# Altium schematic sheet FRONT-UNIT-7.SCHDOC: FRONT-UNIT-7INCH
size A2; DocumentNumber: 1; Revision: 2.0; SheetNumber: 1; SheetTotal: 18; DocumentName: Лист 1.SCHDOC
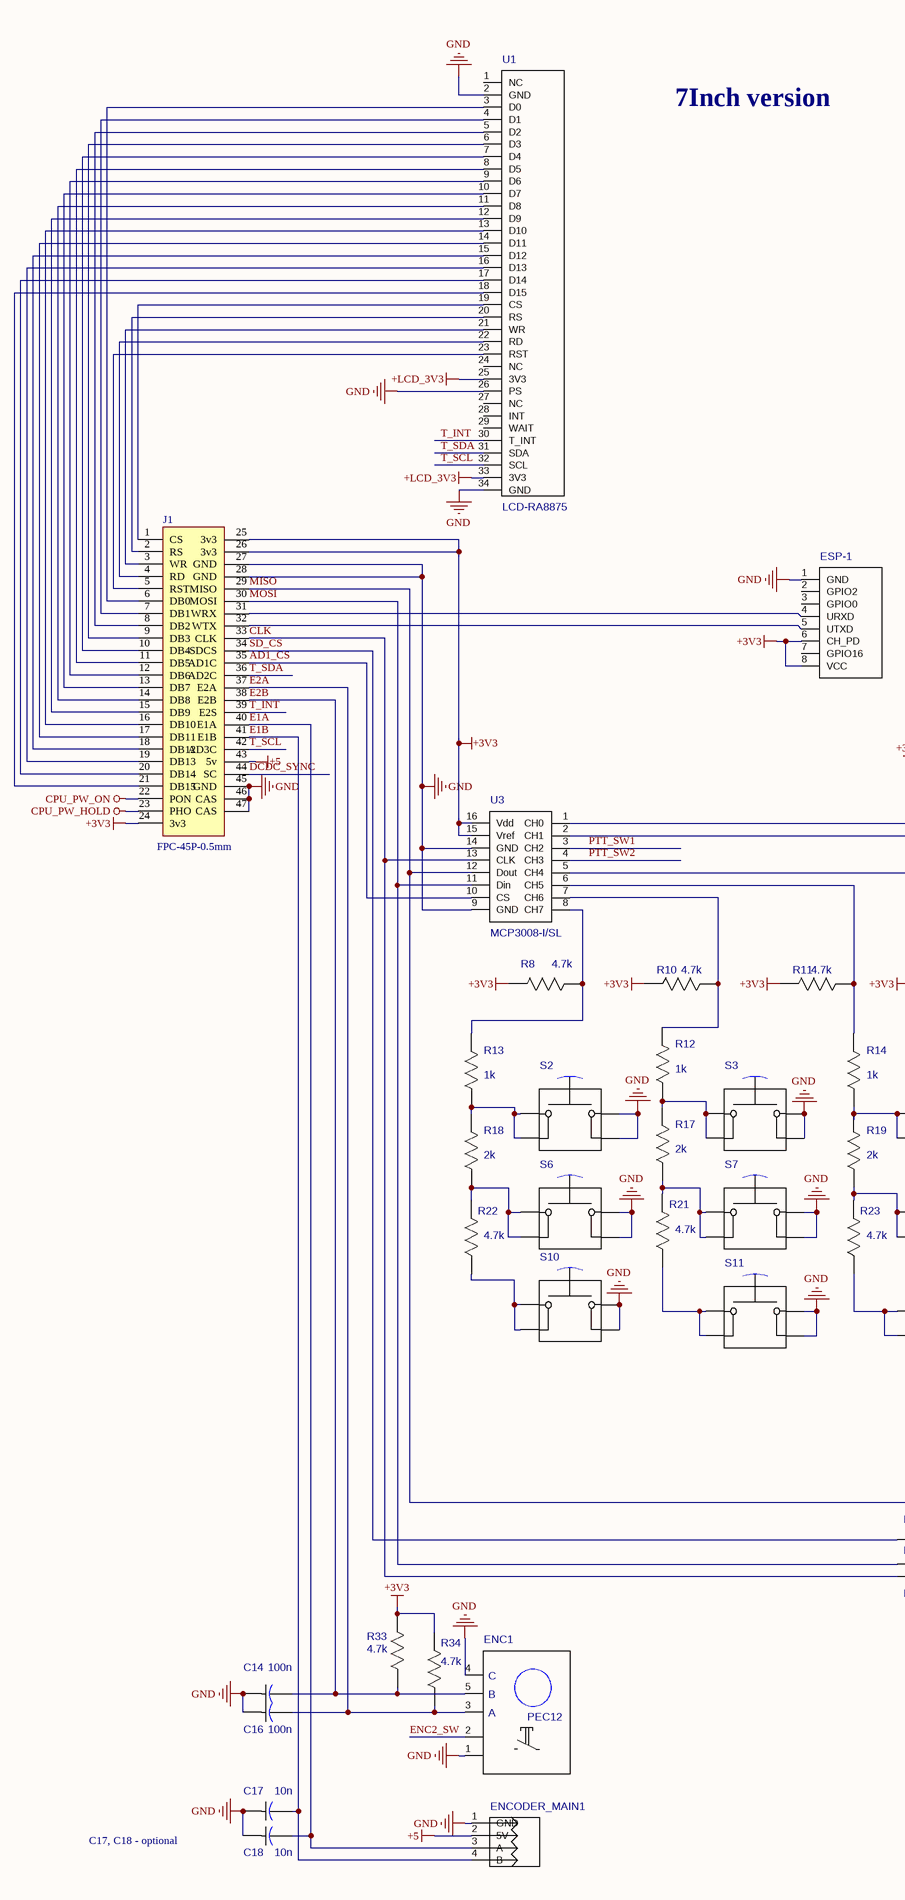
[diagram p0: FRONT-UNIT-7.SCHDOC, left]
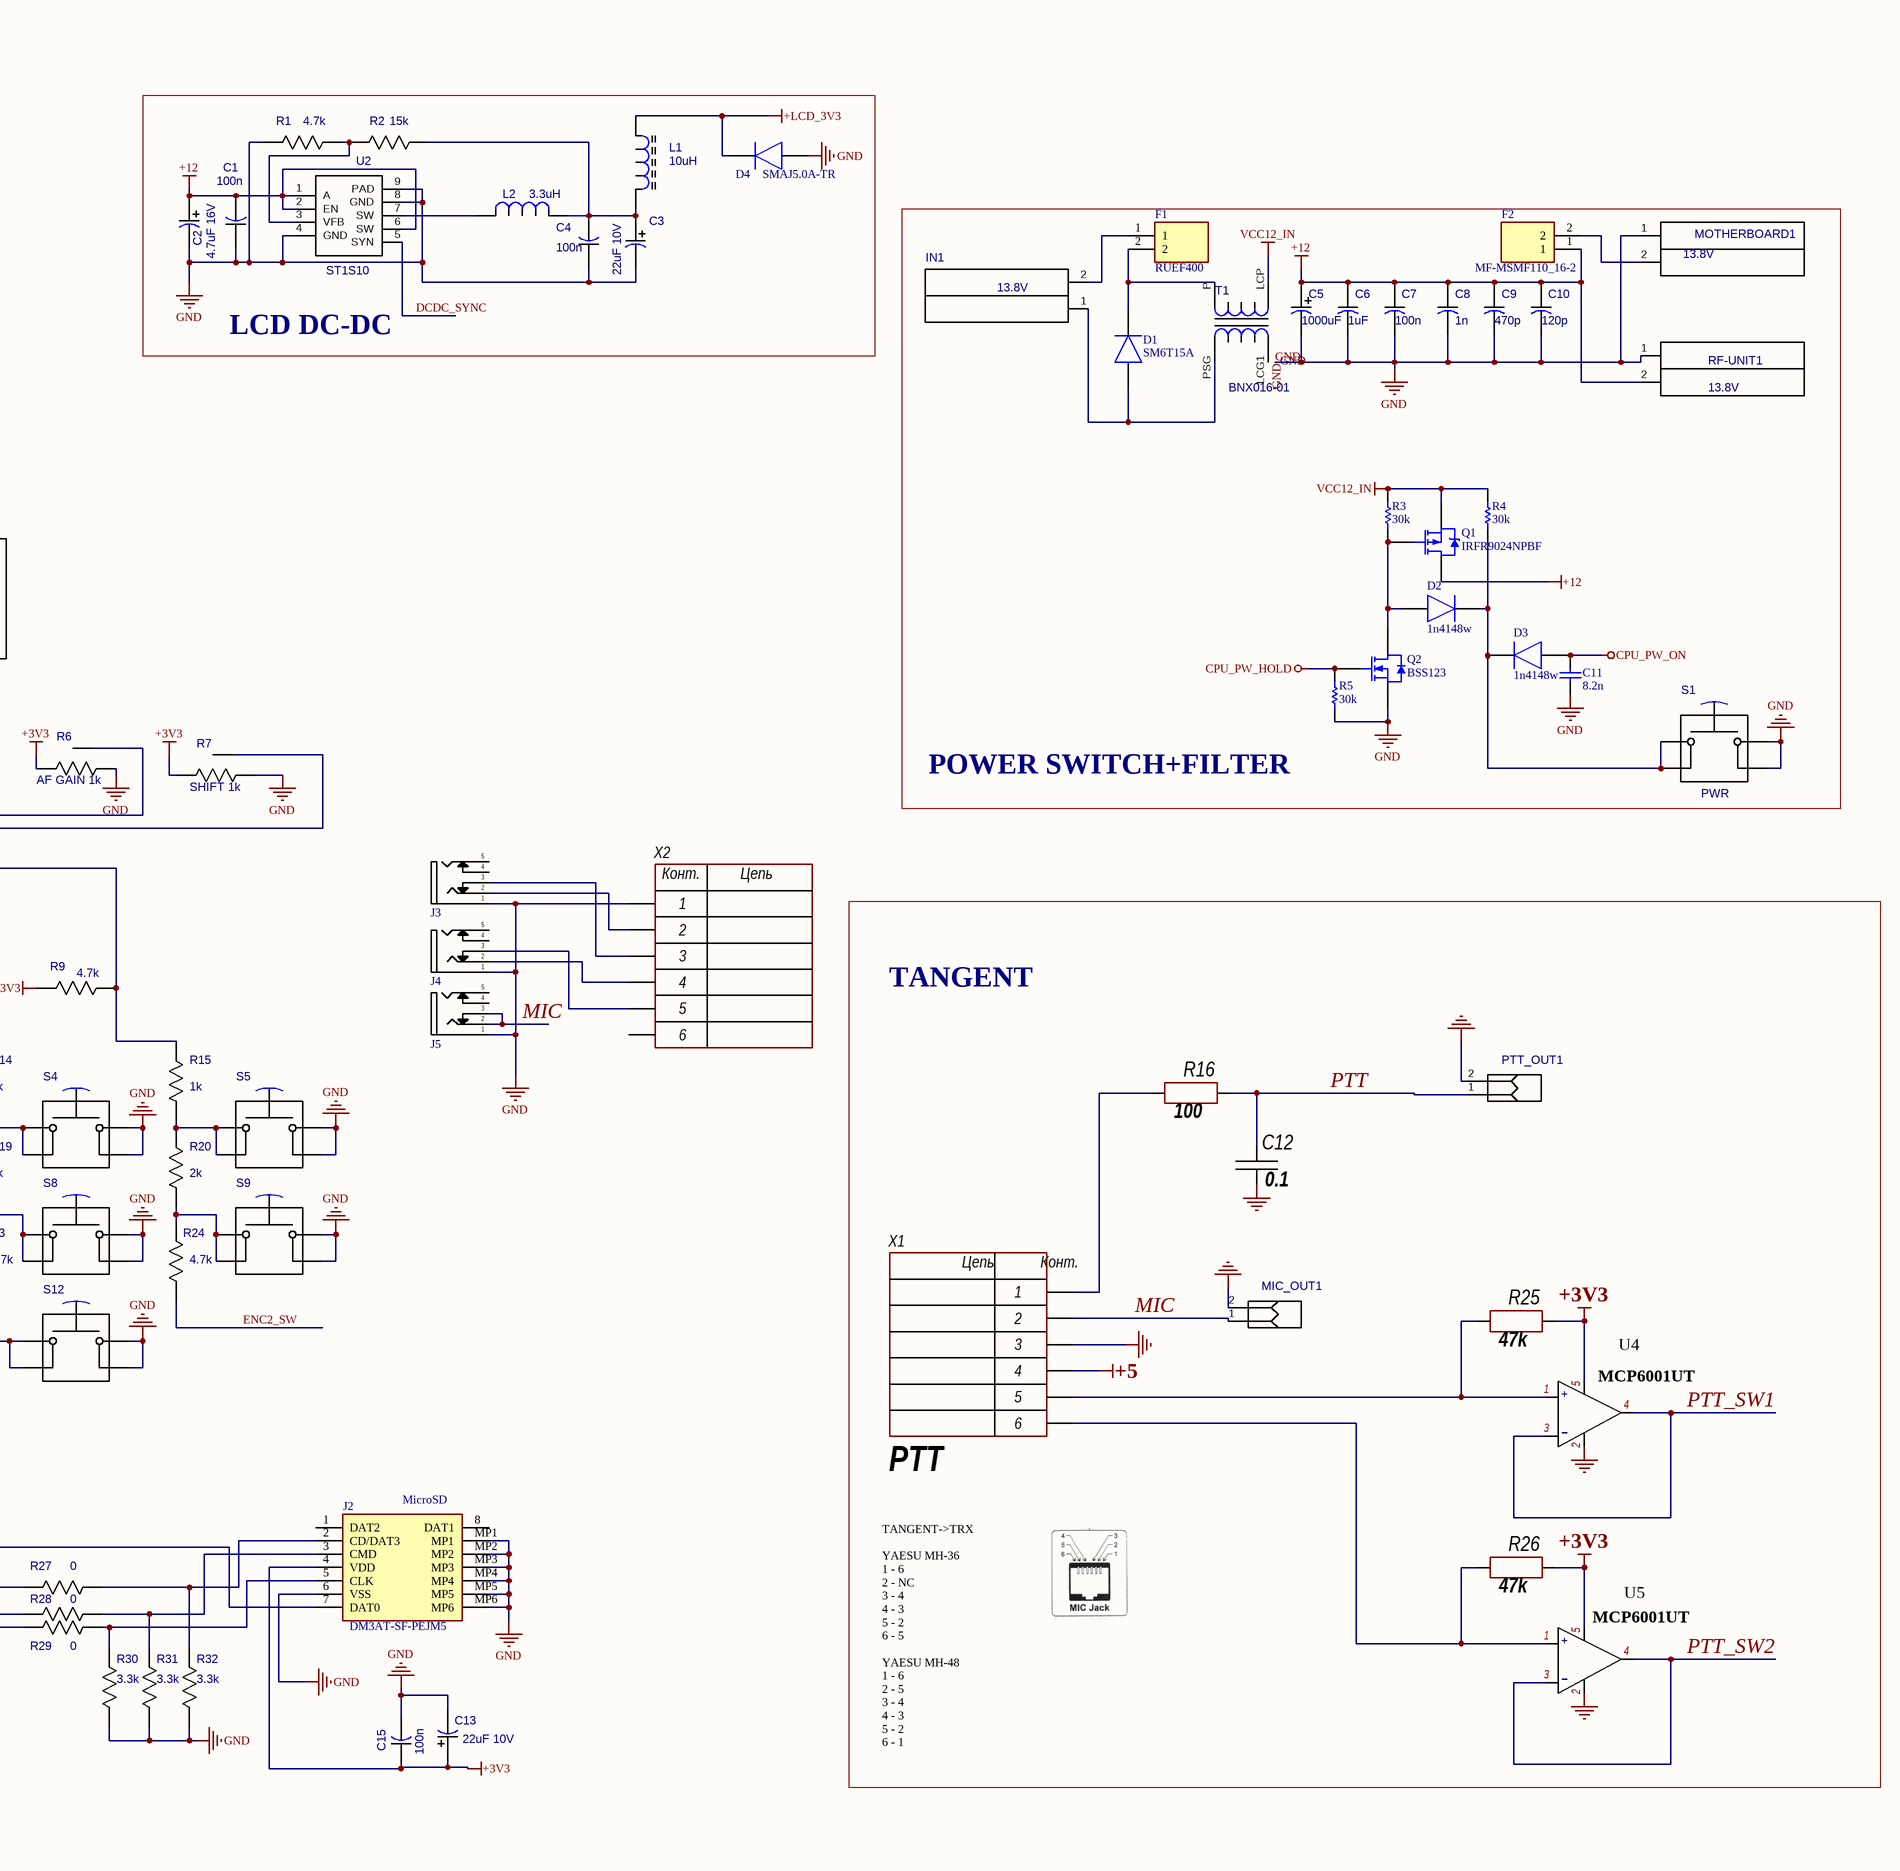
[diagram p1: FRONT-UNIT-7.SCHDOC, right]

## Parts
C1  100n  [CAP_0805]
C2  4.7uF 16V  [CAPAE_6.6x6.6h5.4]
C3  22uF 10V  [CAPAE_4.3x4.3h5.4]
C4  100n  [CAP_0805]
C5  1000uF  [CAP250RP]
C6  1uF  [CAP_1206]
C7  100n  [CAP_1206]
C8  1n  [CAP_1206]
C9  470p  [CAP_1206]
C10  120p  [CAP_1206]
C11  8.2n  [CAPC2013X94X50LL20T25]
C12  0.1  [CH0805C]
C13  22uF 10V  [EEEFC_sizeB]
C14  100n  [CAP_0805]
C15  100n  [CAP_0805]
C16  100n  [CAP_0805]
C17  10n  [CAP_0805]
C18  10n  [CAP_0805]
D1  SM6T15A  [SMBJ36CATR]
D2  1n4148w  [SOD3716X135N]
D3  1n4148w  [SOD3716X135N]
D4  SMAJ5.0A-TR  [SMBJ36CATR]
ENC1  PEC12  [PEC12]
ENCODER_MAIN1  OPTICAL ENCODER  [644456-4]  (value not drawn)
ESP-1  ESP-01 ESP8266  [ESP-01 ESP8266]  (value not drawn)
F1  RUEF400  [RUEF400]
F2  MF-MSMF110_16-2  [FUSC4632X85N]
IN1  value 13.8V  [JX2]  (hidden comment: JX2)
J1  FPC-45P-0.5mm  [FH12S45S05SH60]
J2  DM3AT-SF-PEJM5  [DM3ATSFPEJM5]
J3  PJ-3,5  [Audio-PJ-392]  (value not drawn)
J4  PJ-3,5  [Audio-PJ-392]  (value not drawn)
J5  PJ-3,5  [Audio-PJ-392]  (value not drawn)
L1  10uH  [IND_FERRITE_CORE]
L2  3.3uH  [IND_1812]
MIC_OUT1  MIC_OUT  [51022-0200]  (value not drawn)
MOTHERBOARD1  value 13.8V  [JX2]  (hidden comment: JX2)
PTT_OUT1  PTT_OUT  [51022-0200]  (value not drawn)
Q1  IRFR9024NPBF  [ONSC-DPAK-3-369C-01_V]
Q2  BSS123  [FAIR-SOT23-3_V]
R1  4.7k  [RES_0805]
R2  15k  [RES_0805]
R3  30k  [RESC2013X60X40NL20T25]
R4  30k  [RESC2013X60X40NL20T25]
R5  30k  [RESC2013X60X40NL20T25]
R6  value AF GAIN 1k  [PTV09]  (hidden comment: ptv09a-4225f-b102)
R7  value SHIFT 1k  [PTV09]  (hidden comment: ptv09a-4225f-b102)
R8  4.7k  [RES_0805]
R9  4.7k  [RES_0805]
R10  4.7k  [RES_0805]
R11  4.7k  [RES_0805]
R12  1k  [RES_0805]
R13  1k  [RES_0805]
R14  1k  [RES_0805]
R15  1k  [RES_0805]
R16  100  [CH0805R]
R17  2k  [RES_0805]
R18  2k  [RES_0805]
R19  2k  [RES_0805]
R20  2k  [RES_0805]
R21  4.7k  [RES_0805]
R22  4.7k  [RES_0805]
R23  4.7k  [RES_0805]
R24  4.7k  [RES_0805]
R25  47k  [CH0805R]
R26  47k  [CH0805C]
R27  0  [RES_0805]
R28  0  [RES_0805]
R29  0  [RES_0805]
R30  3.3k  [RES_0805]
R31  3.3k  [RES_0805]
R32  3.3k  [RES_0805]
R33  4.7k  [RES_0805]
R34  4.7k  [RES_0805]
RF-UNIT1  value 13.8V  [JX2]  (hidden comment: JX2)
S1  value PWR  [PTS645SK50LFS]  (hidden comment: PTS645SK50LFS)
S2  PTS645SK50LFS  [PTS645SK50LFS]  (value not drawn)
S3  PTS645SK50LFS  [PTS645SK50LFS]  (value not drawn)
S4  PTS645SK50LFS  [PTS645SK50LFS]  (value not drawn)
S5  PTS645SK50LFS  [PTS645SK50LFS]  (value not drawn)
S6  PTS645SK50LFS  [PTS645SK50LFS]  (value not drawn)
S7  PTS645SK50LFS  [PTS645SK50LFS]  (value not drawn)
S8  PTS645SK50LFS  [PTS645SK50LFS]  (value not drawn)
S9  PTS645SK50LFS  [PTS645SK50LFS]  (value not drawn)
S10  PTS645SK50LFS  [PTS645SK50LFS]  (value not drawn)
S11  PTS645SK50LFS  [PTS645SK50LFS]  (value not drawn)
S12  PTS645SK50LFS  [PTS645SK50LFS]  (value not drawn)
T1  BNX016-01  [TRANSF_ICORE]
U1  LCD-RA8875  [LCD-RA8875]
U2  ST1S10  [ST1S10]
U3  MCP3008-I/SL  [MCP3008-I/SL]
U4  MCP6001UT  [SOT23-5]
U5  MCP6001UT  [SOT23-5]
X1  PTT  [CON: PLS-6]
X2  PTT  [CON: PLS-6]  (value not drawn)

## Blocks framed on the sheet
LCD DC-DC: C1-C4 D4 L1 L2 R1 R2 U2
POWER SWITCH+FILTER: C5-C11 D1-D3 F1 F2 IN1 MOTHERBOARD1 Q1 Q2 R3-R5 RF-UNIT1 S1 T1
TANGENT: C12 MIC_OUT1 PTT_OUT1 R16 R25 R26 U4 U5 X1

## Nets
+3V3: C13.1(PLUS) C15.1 ESP-1.6(CH_PD) ESP-1.8(VCC) J1.24(3v3) J1.25(3v3) J1.26(3v3) J2.4(VDD) R6.1(CW) R7.1(CW) R8.2 R9.2 R10.2 R11.2 R25.2 R26.2 R33.2 R34.2 U3.15(Vref) U3.16(Vdd) U4.5 U5.5
+5: ENCODER_MAIN1.2(5V) J1.43(5v) X1.4
+12: C1.2 C2.1(PLUS) C5.1(PLUS) C6.1 C7.1 C8.1 C9.1 C10.1 F2.1 Q1.4(D) RF-UNIT1.2 U2.1(A) U2.2(EN) U2.6(SW)
+LCD_3V3: D4.1(K) L1.1(A) U1.25(3V3) U1.33(3V3)
CPU_PW_HOLD: J1.23(PHO) Q2.1(G) R5.2
CPU_PW_ON: C11.2 D3.2(A) J1.22(PON)
GND: C1.1 C2.2(MINUS) C3.2(MINUS) C4.1 C5.2(MINUS) C6.2 C7.2 C8.2 C9.2 C10.2 C11.1 C12.1 C13.2(MINUS) C14.1 C15.2 C16.1 C17.1 C18.1 D4.2(A) ENC1.1 ENC1.4(C) ENCODER_MAIN1.1(GND) ESP-1.1(GND) J1.27(GND) J1.28(GND) J1.45(GND) J1.46(CAS) J1.47(CAS) J2.6(VSS) J2.MP1 J2.MP2 J2.MP3 J2.MP4 J2.MP5 J2.MP6 J3.1 J4.1 J5.1 MIC_OUT1.2 MOTHERBOARD1.1 PTT_OUT1.2 Q2.2(S) R1.1 R5.1 R6.3(CCW) R7.3(CCW) R30.1 R31.1 R32.1 RF-UNIT1.1 S1.3(B) S1.4(B) S2.3(B) S2.4(B) S3.3(B) S3.4(B) S4.3(B) S4.4(B) S5.3(B) S5.4(B) S6.3(B) S6.4(B) S7.3(B) S7.4(B) S8.3(B) S8.4(B) S9.3(B) S9.4(B) S10.3(B) S10.4(B) S11.3(B) S11.4(B) S12.3(B) S12.4(B) T1.LCG1(S2) U1.2(GND) U1.26(PS) U1.34(GND) U2.4(GND) U2.8(GND) U2.9(PAD) U3.9(GND) U3.14(GND) U4.2 U5.2 X1.3 X2.1
VCC12_IN: Q1.3(S) R3.2 R4.2 T1.LCP(P2)
AD1_CS: J1.35(AD1C) U3.10(CS)
CLK: J1.33(CLK) R29.2 U3.13(CLK)
DCDC_SYNC: J1.44(SC) U2.5(SYN)
E1A: C18.2 ENCODER_MAIN1.3(A) J1.40(E1A)
E1B: C17.2 ENCODER_MAIN1.4(B) J1.41(E1B)
E2A: C16.2 ENC1.3(A) J1.37(E2A) R34.1
E2B: C14.2 ENC1.5(B) J1.38(E2B) R33.1
ENC2_SW: ENC1.2 R24.1
MIC: J5.2 J5.3 MIC_OUT1.1 X1.2
MISO: J1.29(MISO) J2.7(DAT0) U3.12(Dout)
MOSI: J1.30(MOSI) R28.2 U3.11(Din)
PTT: C12.2 PTT_OUT1.1 R16.2
PTT_SW1: U3.3(CH2) U4.3 U4.4
PTT_SW2: U3.4(CH3) U5.3 U5.4
SD_CS: J1.34(SDCS) R27.2
T_INT: J1.39(E2S) U1.30(T_INT)
T_SCL: J1.42(AD3C) U1.32(SCL)
T_SDA: J1.36(AD2C) U1.31(SDA)
NetC3_1: C3.1(PLUS) C4.2 L1.2(B) L2.2 R2.2
NetD1_1: D1.1(K) F1.2 T1.P(P1)
NetD1_2: D1.2(A) IN1.1 T1.PSG(S1)
NetD2_1: D2.1(K) D3.1(K) R4.1 S1.1(A) S1.2(A)
NetD2_2: D2.2(A) Q1.1(G) Q2.3(D) R3.1
NetESP-1_4: ESP-1.4(URXD) J1.31(WRX)
NetESP-1_5: ESP-1.5(UTXD) J1.32(WTX)
NetF1_1: F1.1 IN1.2
NetF2_2: F2.2 MOTHERBOARD1.2
NetJ1_1: J1.1(CS) U1.19(CS)
NetJ1_2: J1.2(RS) U1.20(RS)
NetJ1_3: J1.3(WR) U1.21(WR)
NetJ1_4: J1.4(RD) U1.22(RD)
NetJ1_5: J1.5(RST) U1.23(RST)
NetJ1_6: J1.6(DB0) U1.3(D0)
NetJ1_7: J1.7(DB1) U1.4(D1)
NetJ1_8: J1.8(DB2) U1.5(D2)
NetJ1_9: J1.9(DB3) U1.6(D3)
NetJ1_10: J1.10(DB4) U1.7(D4)
NetJ1_11: J1.11(DB5) U1.8(D5)
NetJ1_12: J1.12(DB6) U1.9(D6)
NetJ1_13: J1.13(DB7) U1.10(D7)
NetJ1_14: J1.14(DB8) U1.11(D8)
NetJ1_15: J1.15(DB9) U1.12(D9)
NetJ1_16: J1.16(DB10) U1.13(D10)
NetJ1_17: J1.17(DB11) U1.14(D11)
NetJ1_18: J1.18(DB12) U1.15(D12)
NetJ1_19: J1.19(DB13) U1.16(D13)
NetJ1_20: J1.20(DB14) U1.17(D14)
NetJ1_21: J1.21(DB15) U1.18(D15)
NetJ2_2: J2.2(CD/DAT3) R27.1 R32.2
NetJ2_3: J2.3(CMD) R28.1 R31.2
NetJ2_5: J2.5(CLK) R29.1 R30.2
NetJ3_2: J3.2 X2.2
NetJ3_3: J3.3 X2.3
NetJ4_2: J4.2 X2.4
NetJ4_3: J4.3 X2.5
NetL2_1: L2.1 U2.7(SW)
NetR1_2: R1.2 R2.1 U2.3(VFB)
NetR6_2: R6.2(W) U3.1(CH0)
NetR7_2: R7.2(W) U3.2(CH1)
NetR8_1: R8.1 R13.2 U3.8(CH7)
NetR9_1: R9.1 R15.2 U3.5(CH4)
NetR10_1: R10.1 R12.2 U3.7(CH6)
NetR11_1: R11.1 R14.2 U3.6(CH5)
NetR12_1: R12.1 R17.2 S3.1(A) S3.2(A)
NetR13_1: R13.1 R18.2 S2.1(A) S2.2(A)
NetR14_1: R14.1 R19.2 S4.1(A) S4.2(A)
NetR15_1: R15.1 R20.2 S5.1(A) S5.2(A)
NetR16_1: R16.1 X1.1
NetR17_1: R17.1 R21.2 S7.1(A) S7.2(A)
NetR18_1: R18.1 R22.2 S6.1(A) S6.2(A)
NetR19_1: R19.1 R23.2 S8.1(A) S8.2(A)
NetR20_1: R20.1 R24.2 S9.1(A) S9.2(A)
NetR21_1: R21.1 S11.1(A) S11.2(A)
NetR22_1: R22.1 S10.1(A) S10.2(A)
NetR23_1: R23.1 S12.1(A) S12.2(A)
NetR25_1: R25.1 U4.1 X1.5
NetR26_1: R26.1 U5.1 X1.6

Not connected (* = marked no-connect by the designer): ESP-1 2(GPIO2) 3(GPIO0) 7(GPIO16); J2 1(DAT2) 8(DAT1); J3 4(5) 5(4); J4 4(5) 5(4); J5 4(5) 5(4); U1 1(NC) 24(NC) 27(NC) 28(INT) 29(WAIT); X2 6

## Notes on the sheet
- 7Inch version
- (near J2) MicroSD
- TANGENT->TRX
  YAESU MH-36
  1 - 6
  2 - NC
  3 - 4
  4 - 3
  5 - 2
  6 - 5
  YAESU MH-48
  1 - 6
  2 - 5
  3 - 4
  4 - 3
  5 - 2
  6 - 1
- С17, C18 - optional
- Labels drawn without touching a wire or pin: GND
- Title
- Size:
- Date:
- File:
- A2
- Number:
- Time:
- Revision:
- Sheet
- of
- (in symbol 6-Connector) Цепь; Конт.
- (in symbol MCP6001UT_1) +; -

## Library data of the parts
C1 C4 C14-C18 = CAP_0805
  C1 C4 C14-C16: Value: 100n
C2 = CAPAE_6.6x6.6h5.4: Value: 4.7uF 16V
C3 = CAPAE_4.3x4.3h5.4: Value: 22uF 10V
C5 = CAP250RP: Value: 1000uF
C6-C10 = CAP_1206
  C6: Value: 1uF
  C7: Value: 100n
  C8: Value: 1n
C11 = CMP-2007-04444-1: CAP_1206; Manufacturer: AVX Interconnect / Elco; Part Number: 08055C822KAT2A
C12 = Capacitor: Manufacturer: *; Model: *; HelpURL: *; ComponentKind: *; Value: *
C13 = EEEFC_sizeB: Value: 22uF 10V
D1 = SM6T15A: Diode; Manufacturer_Name: STMicroelectronics; Allied_Number: 70390432; Datasheet Link: http://www.st.com/web/en/resource/technical/document/datasheet/CD00000725.pdf; Height: 2.65mm; Manufacturer_Part_Number: SM6T15A; Mouser Part Number: 511-SM6T15A; Mouser Price/Stock: https://www.mouser.com/Search/Refine.aspx?Keyword=511-SM6T15A; RS Part Number: 4864915P; RS Price/Stock: http://uk.rs-online.com/web/p/products/4864915P; Allied Price/Stock: http://www.alliedelec.com/stmicroelectronics-sm6t15a/70390432/
D2 D3 = 1n4148w: Diode; Manufacturer_Name: Vishay; Datasheet Link: http://www.vishay.com/docs/85748/1n4148w.pdf; Height: 1.35mm; Manufacturer_Part_Number: 1n4148w
D4 = SMLVT3V3: Diode; Manufacturer_Name: STMicroelectronics; Allied_Number: 70013736; Datasheet Link: http://www.st.com/web/en/resource/technical/document/datasheet/CD00000923.pdf; Height: 2.65mm; Manufacturer_Part_Number: SMLVT3V3; Mouser Part Number: 511-SMLVT3V3; Mouser Price/Stock: https://www.mouser.com/Search/Refine.aspx?Keyword=511-SMLVT3V3; RS Part Number: 5444821P; RS Price/Stock: http://uk.rs-online.com/web/p/products/5444821P; Allied Price/Stock: http://www.alliedelec.com/stmicroelectronics-smlvt3v3/70013736/; LCSC Part #: test
ENC1 = PEC12: FULLNAME: Выключатель замыкающий с приводом нажатием кнопки; Value: PEC12
ENCODER_MAIN1 = 644456-4
F1 = RUEF400: Fuse; Manufacturer_Name: LITTELFUSE; Datasheet Link: https://componentsearchengine.com/Datasheets/1/RUEF400.pdf; Height: 19mm; Manufacturer_Part_Number: RUEF400; Mouser Part Number: 650-RUEF400; Mouser Price/Stock: https://www.mouser.co.uk/ProductDetail/Littelfuse/RUEF400?qs=hv6pn79dJPQHuFVnpNF%2FDg%3D%3D; RS Part Number: 5176837P; RS Price/Stock: http://uk.rs-online.com/web/p/products/5176837P
F2 = MF-MSMF110_16-2: Fuse; Manufacturer_Name: Bourns; Manufacturer_Part_Number: MF-MSMF110/16-2; Allied_Number: 70153434; Datasheet Link: https://componentsearchengine.com/Datasheets/2/MF-MSMF110_16-2.pdf; Height: 0.85mm; Mouser Part Number: 652-MF-MSMF110/16-2; Mouser Price/Stock: https://www.mouser.co.uk/ProductDetail/Bourns/MF-MSMF110-16-2?qs=wksszfECgvir54ST3ixUHA%3D%3D; RS Part Number: 6478207P; RS Price/Stock: http://uk.rs-online.com/web/p/products/6478207P; Allied Price/Stock: https://www.alliedelec.com/bourns-mf-msmf110-16-2/70153434/
J1 = FH12S-45S-0.5SH_55_: Connector; Manufacturer_Name: Hirose; Manufacturer_Part_Number: FH12S-45S-0.5SH(55); Datasheet Link: https://www.hirose.com/product/en/download_file/key_name/FH12S-45S-0.5SH%2855%29/category/Drawing%20(2D)/doc_file_id/43881/?file_category_id=6&item_id=05860665055&is_series=; Height: 2mm; Mouser Part Number: 798-FH12S-45S-05SH55; Mouser Price/Stock: https://www.mouser.co.uk/ProductDetail/Hirose-Connector/FH12S-45S-05SH55?qs=0N%252BVULUZFj%252BE0LA99Ny0NA%3D%3D; RS Part Number: 1620942; RS Price/Stock: http://uk.rs-online.com/web/p/products/1620942
J2 = DM3AT-SF-PEJM5: Connector; Manufacturer_Name: HRS(Hirose); Datasheet Link: https://datasheet.lcsc.com/szlcsc/Hirose-HRS-DM3AT-SF-PEJM5_C114218.pdf; Height: 1.83mm; Manufacturer_Part_Number: DM3AT-SF-PEJM5
L1 = IND_FERRITE_CORE: Inductor; Value: 10uH
L2 = IND_1812: Value: 3.3uH
MIC_OUT1 PTT_OUT1 = 51022-0200
Q1 = CMP-1058-00387-1: IRFR9024NPBF, Транзистор, Р-канал 55В 11А; Manufacturer: On Semiconductor; PartNumber: NTD2955G; Ciss Typ (pF): 500; Qrr Typ (nC): 100; VGS Max (V): 20; PD Max (W): 55; Channel Polarity: P Channel; V(BR)DSS Min (V): 60; ID Max (A): 12; Configuration: Single; Crss Typ (pF): 50; Packing: Tape and Reel; VGS(th) Max (V): 4; Coss Typ (pF): 150; RoHS: Pb-Free; ComponentLink1Description: Manufacturer URL; Mounting Technology: Surface Mount; ComponentLink2URL: http://www.onsemi.cn/pub_link/Collateral/NTD2955-D.PDF; PackageDescription: 3-Pin Flange Mount, Body 6.54 x 6.095 mm, Pitch 2.29 mm; ComponentLink3Description: Package Specification; Package Type: DPAK-3, IPAK-4; ComponentLink3URL: http://www.onsemi.cn/pub_link/Collateral/369C.PDF; DatasheetVersion: Rev. 13; ComponentLink2Description: Datasheet; ComponentLink1URL: http://www.onsemi.com/; PackageVersion: Rev. E, 02/2014; PackageReference: DPAK-3-369C-01
Q2 = CMP-2000-04934-1: N-Channel Logic Level Enhancement Mode Field Effect Transistor, 1.7 V, -55 to 150 degC, 3-Pin SOT-23, RoHS, Tape and Reel; Manufacturer: Fairchild; Channel Type: N; Typical Turn-Off Delay Time: 17ns; Maximum Continuous Drain Current: 0.17A; Rad Hard: No; Typical Rise Time: 9ns; Typical Fall Time: 2.4ns; Maximum Gate Source Voltage: ±20V; Maximum Drain Source Voltage: 100V; Typical Turn-On Delay Time: 1.7ns; RDS-on: 6000@10VmOhm; Package Version: Rev. 12, 03/2016; Packaging: Tape&Reel; Package Reference: SOT23-3; Channel Mode: Enhancement; Operating Temperature: -55to150degC; Package Description: 3-Pin Small Outline Transistor, Body 2.92 x 1.325 mm, Pitch 0.95 mm; Category: MOSFET; Datasheet Version: Jun-03; Datasheet URL: https://www.fairchildsemi.com/datasheets/BS/BSS123.pdf; Manufacturer URL: https://www.fairchildsemi.com/; Mounting: SurfaceMount; Package: 3SOT-23; Package URL: http://www.fairchildsemi.com/dwg/MA/MA03D.pdf
R1 R2 R8-R15 R17-R24 R27-R34 = RES_0805
  R8-R11 R33 R34: Value: 4.7k
  R27-R29: Value: 0
  R30-R32: Value: 3.3k
R3-R5 = CMP-2001-00626-1: RES_0805; Manufacturer: Panasonic; Part Number: ERA-6AEB303V
R6 R7 = PTV09: Adjustable Resistor PTV09
R16 R25 R26 = Resistor: Manufacturer: *; Model: *; HelpURL: *; ComponentKind: *; Value: *
T1 = TRANSF_ICORE: Value: BNX016-01
U4 U5 = MCP6001UT_1
X1 X2 = 6-Connector: Model: *; Manufacturer: *; HelpURL: *; ComponentKind: *
ESP-1 = ESP-01 ESP8266: Value: ESP-01 ESP8266
S1-S12 = PTS645SK50LFS
  S2: LCSC Part #: test
U1 = LCD-RA8875: Value: *
U2 = ST1S10: Value: ST1S10
U3 = MCP3008-I/SL: Value: MCP3008-I/SL